# Altium schematic sheet OMD_Fets_80A.SchDoc
size A4; Organization: Altium Limited; Address1: L3, 12a Rodborough Rd; Address2: Frenchs Forest; Address3: NSW; Address4: Australia 2086
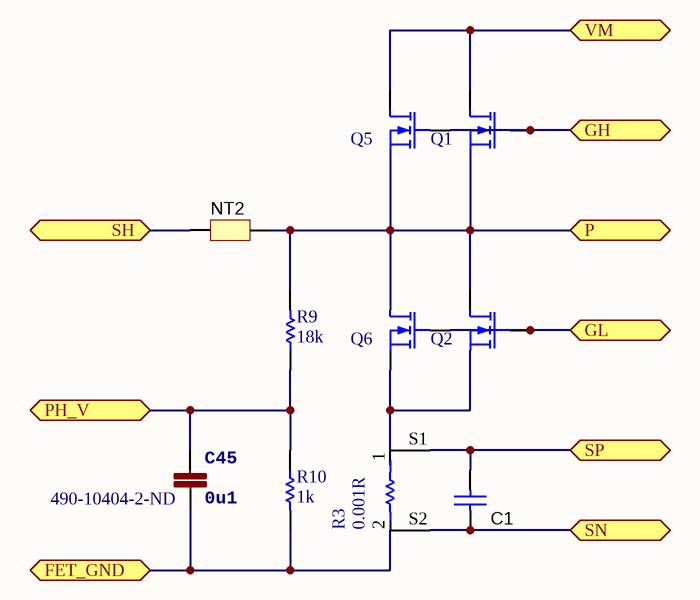
[diagram p0: OMD_Fets_80A.SchDoc]

## Parts
C1  (no value)  [0603-CAP]
C45  0u1  Supplier Part Number 1: 490-10404-2-ND  [0201-cap]
NT2  Net-Tie  [Net-Tie_10mil]  (value not drawn)  (net tie, no BOM)
Q1  MOSFET-N  [Q5B]  (value not drawn)
Q2  MOSFET-N  [Q5B]  (value not drawn)
Q5  MOSFET-N  [Q5B]  (value not drawn)
Q6  MOSFET-N  [Q5B]  (value not drawn)
R3  value 0.001R  [4RESC5125X09N]  (hidden comment: Current sense resistor)
R9  value 18k  [R0805]  (hidden comment: RES)
R10  value 1k  [R0805]  (hidden comment: RES)

## Ports
FET_GND, GH, GL, P, PH_V, SH, SN, SP, VM

## Nets
FET_GND: C45.2 R3.2 R10.2 ; port FET_GND
GH: Q1.G Q5.G ; port GH
GL: Q2.G Q6.G ; port GL
P: NT2.2 Q1.S Q2.D Q5.S Q6.D R9.2 ; port P
PH_V: C45.1 R9.1 R10.1 ; port PH_V
SH: NT2.1 ; port SH
SN: C1.2 R3.S2 ; port SN
SP: C1.1 R3.S1 ; port SP
VM: Q1.D Q5.D ; port VM
NetQ2_S: Q2.S Q6.S R3.1

## Notes on the sheet
- https://github.com/OpenMotorDrive
- https://creativecommons.org/licenses/by-nc-sa/4.0/
- For Commercial use, please contact ProfiCNC
- Title
- Size:
- Date:
- A4
- Number:
- Time:
- Revision:
- Sheet
- of
- ProfiCNC Pty. Ltd.
- ProfiCNC does NOT guaranty these drawings as fit for any purpose, you must verify this information before attempting to use it in any way.  USE AT OWN RISK
- File:

## Library data of the parts
C1 = GRM188R71C102KA01D: CAP, CERM, 1000pF, 16V, +/-10%, X7R, 0603; Value: 1000pF; Supplier 1: Digi-Key; Supplier Part Number 1: GRM188R71C102KA01D-ND
C45 = CAP0402: CAP CER 0.1UF 6V Y5V 0201; Supplier 1: Digi-Key
NT2 = Net-Tie: Single point connection between nets.
Q1 Q2 Q5 Q6 = MOSFET-N: N-Channel MOSFET; Supplier 1: Digi-Key; Supplier Part Number 1: 296-37194-1-ND
R3 = WSLP20101L000FEK: 2W, 0.001R 5025 current sense resistor; Supplier 1: Digi-Key; Supplier Part Number 1: CSNL2010FT1L00CT-ND
R9 = R00155: RES SMD 18K OHM 1% 1/8W 0805; Supplier 1: Digi-Key; Supplier Part Number 1: 311-18.0KCRCT-ND
R10 = R00095: RES SMD 1K OHM 1% 1/8W 0805; Supplier 1: Digi-Key; Supplier Part Number 1: 311-1.00KCRCT-ND